# Altium schematic sheet mc_wl.SchDoc
size A4
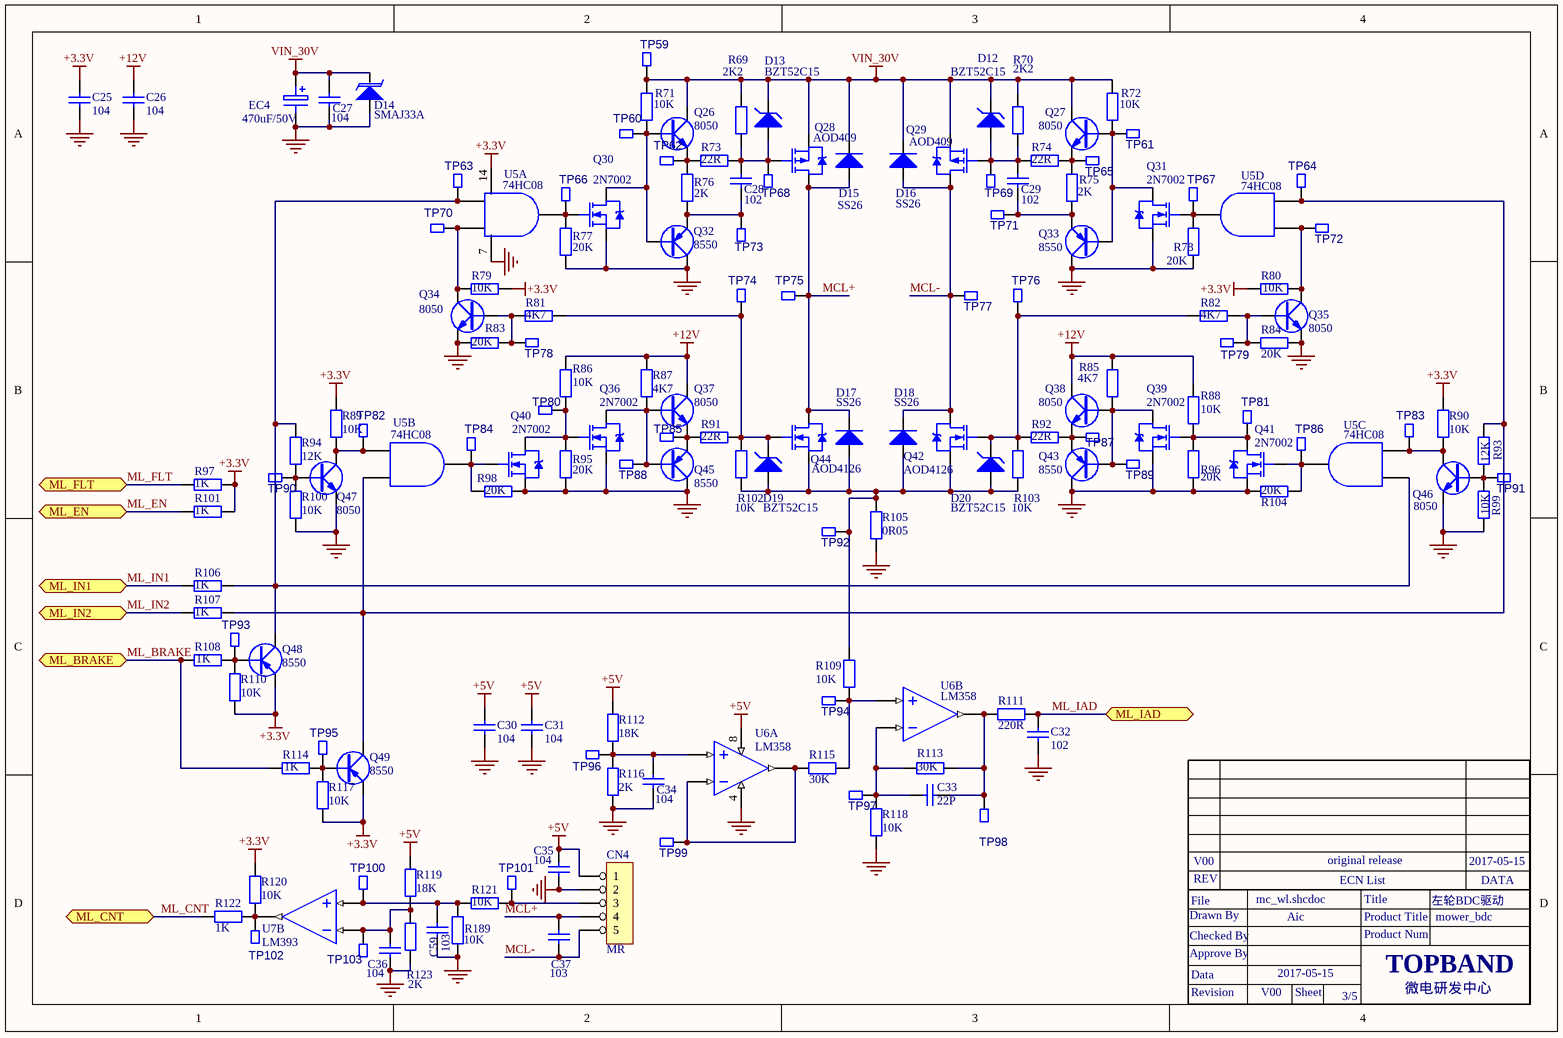
[diagram p0: mc_wl.SchDoc]

## Parts
C25  104  [0603C]
C26  104  [0603C]
C27  104  [0805C]
C28  102  [0805C]
C29  102  [0805C]
C30  104  [0603C]
C31  104  [0603C]
C32  102  [0603C]
C33  22P  [0603C]
C34  104  [0603C]
C35  104  [0603C]
C36  104  [0603C]
C37  103  [1206C]
C59  103  [0603C]
CN4  MR  [CON5-2.54]
D12  BZT52C15  [SOD-123]
D13  BZT52C15  [SOD-123]
D14  SMAJ33A  [DO-214AC]
D15  SS26  [SMB]
D16  SS26  [SMB]
D17  SS26  [SMB]
D18  SS26  [SMB]
D19  BZT52C15  [SOD-123]
D20  BZT52C15  [SOD-123]
EC4  470uF/50V  [EC12.5]
Q26  8050  [SOT-23-BCE]
Q27  8050  [SOT-23-BCE]
Q28  AOD409  [D-PACK-GDS]
Q29  AOD409  [D-PACK-GDS]
Q30  2N7002  [SOT-23-GDS]
Q31  2N7002  [SOT-23-GDS]
Q32  8550  [SOT-23-BCE]
Q33  8550  [SOT-23-BCE]
Q34  8050  [SOT-23-BCE]
Q35  8050  [SOT-23-BCE]
Q36  2N7002  [SOT-23-GDS]
Q37  8050  [SOT-23-BCE]
Q38  8050  [SOT-23-BCE]
Q39  2N7002  [SOT-23-GDS]
Q40  2N7002  [SOT-23-GDS]
Q41  2N7002  [SOT-23-GDS]
Q42  AOD4126  [D-PACK-GDS]
Q43  8550  [SOT-23-BCE]
Q44  AOD4126  [D-PACK-GDS]
Q45  8550  [SOT-23-BCE]
Q46  8050  [SOT-23-BCE]
Q47  8050  [SOT-23-BCE]
Q48  8550  [SOT-23-BCE]
Q49  8550  [SOT-23-BCE]
R69  2K2  [0805R]
R70  2K2  [0805R]
R71  10K  [0603R]
R72  10K  [0603R]
R73  22R  [0805R]
R74  22R  [0805R]
R75  2K  [0805R]
R76  2K  [0805R]
R77  20K  [0603R]
R78  20K  [0603R]
R79  10K  [0603R]
R80  10K  [0603R]
R81  4K7  [0603R]
R82  4K7  [0603R]
R83  20K  [0603R]
R84  20K  [0603R]
R85  4K7  [0603R]
R86  10K  [0603R]
R87  4K7  [0603R]
R88  10K  [0603R]
R89  10K  [0603R]
R90  10K  [0603R]
R91  22R  [0805R]
R92  22R  [0805R]
R93  12K  [0603R]
R94  12K  [0603R]
R95  20K  [0603R]
R96  20K  [0603R]
R97  1K  [0603R]
R98  20K  [0603R]
R99  10K  [0603R]
R100  10K  [0603R]
R101  1K  [0603R]
R102  10K  [0603R]
R103  10K  [0603R]
R104  20K  [0603R]
R105  0R05  [2512R]
R106  1K  [0603R]
R107  1K  [0603R]
R108  1K  [0603R]
R109  10K  [0603R]
R110  10K  [0603R]
R111  220R  [0603R]
R112  18K  [0603R]
R113  30K  [0603R]
R114  1K  [0603R]
R115  30K  [0603R]
R116  2K  [0603R]
R117  10K  [0603R]
R118  10K  [0603R]
R119  18K  [0603R]
R120  10K  [0603R]
R121  10K  [0603R]
R122  1K  [0603R]
R123  2K  [0603R]
R189  10K  [0603R]
TP59  TP  [TEST-0.8MM]  (value not drawn)
TP60  TP  [TEST-0.8MM]  (value not drawn)
TP61  TP  [TEST-0.8MM]  (value not drawn)
TP62  TP  [TEST-0.8MM]  (value not drawn)
TP63  TP  [TEST-0.8MM]  (value not drawn)
TP64  TP  [TEST-0.8MM]  (value not drawn)
TP65  TP  [TEST-0.8MM]  (value not drawn)
TP66  TP  [TEST-0.8MM]  (value not drawn)
TP67  TP  [TEST-0.8MM]  (value not drawn)
TP68  TP  [TEST-0.8MM]  (value not drawn)
TP69  TP  [TEST-0.8MM]  (value not drawn)
TP70  TP  [TEST-0.8MM]  (value not drawn)
TP71  TP  [TEST-0.8MM]  (value not drawn)
TP72  TP  [TEST-0.8MM]  (value not drawn)
TP73  TP  [TEST-0.8MM]  (value not drawn)
TP74  TP  [TEST-0.8MM]  (value not drawn)
TP75  TP  [TEST-0.8MM]  (value not drawn)
TP76  TP  [TEST-0.8MM]  (value not drawn)
TP77  TP  [TEST-0.8MM]  (value not drawn)
TP78  TP  [TEST-0.8MM]  (value not drawn)
TP79  TP  [TEST-0.8MM]  (value not drawn)
TP80  TP  [TEST-0.8MM]  (value not drawn)
TP81  TP  [TEST-0.8MM]  (value not drawn)
TP82  TP  [TEST-0.8MM]  (value not drawn)
TP83  TP  [TEST-0.8MM]  (value not drawn)
TP84  TP  [TEST-0.8MM]  (value not drawn)
TP85  TP  [TEST-0.8MM]  (value not drawn)
TP86  TP  [TEST-0.8MM]  (value not drawn)
TP87  TP  [TEST-0.8MM]  (value not drawn)
TP88  TP  [TEST-0.8MM]  (value not drawn)
TP89  TP  [TEST-0.8MM]  (value not drawn)
TP90  TP  [TEST-0.8MM]  (value not drawn)
TP91  TP  [TEST-0.8MM]  (value not drawn)
TP92  TP  [TEST-0.8MM]  (value not drawn)
TP93  TP  [TEST-0.8MM]  (value not drawn)
TP94  TP  [TEST-0.8MM]  (value not drawn)
TP95  TP  [TEST-0.8MM]  (value not drawn)
TP96  TP  [TEST-0.8MM]  (value not drawn)
TP97  TP  [TEST-0.8MM]  (value not drawn)
TP98  TP  [TEST-0.8MM]  (value not drawn)
TP99  TP  [TEST-0.8MM]  (value not drawn)
TP100  TP  [TEST-0.8MM]  (value not drawn)
TP101  TP  [TEST-0.8MM]  (value not drawn)
TP102  TP  [TEST-0.8MM]  (value not drawn)
TP103  TP  [TEST-0.8MM]  (value not drawn)
U5  74HC08  [SO-14]  (parts A,B,C,D of 4)
U6  LM358  [SO-8]  (parts A,B of 2)
U7  LM393  [SO-8]  (part B of 2)

## Ports
ML_BRAKE, ML_CNT, ML_EN, ML_FLT, ML_IAD, ML_IN1, ML_IN2

## Nets
+3.3V: C25.2 Q48.E Q49.E R79.2 R80.1 R89.1 R90.2 R97.2 R101.2 R110.2 R117.2 R120.2 U5.14(VCC)
+5V: C30.2 C31.2 C35.2 CN4.1 R112.2 R119.2 U6.8(VCC)
+12V: C26.2 Q37.C Q38.C R85.1 R86.2 R87.2 R88.2
GND: C25.1 C26.1 C27.1 C30.1 C31.1 C32.2 C34.1 C35.1 C36.1 C59.1 CN4.2 D14.A EC4.2 Q30.S Q31.S Q32.C Q33.C Q34.E Q35.E Q36.S Q39.S Q40.S Q41.S Q43.C Q45.C Q46.E Q47.E R77.2 R78.1 R83.1 R84.2 R95.2 R96.2 R98.2 R99.1 R100.1 R104.1 R105.1 R116.1 R118.1 R123.1 R189.2 U5.7(GND) U6.4(GND)
VIN_30V: C27.2 D12.K D13.K D14.K D15.K D16.K EC4.1 Q26.C Q27.C Q28.S Q29.S R69.1 R70.1 R71.1 R72.1 TP59.1
MCL+: C37.2 CN4.4 D15.A D17.K Q28.D Q44.D TP75.1
MCL-: C37.1 CN4.5 D16.A D18.K Q29.D Q42.D TP77.1
ML_BRAKE: R108.2 R114.2 ; port ML_BRAKE
ML_CNT: R122.1 ; port ML_CNT
ML_EN: R101.1 ; port ML_EN
ML_FLT: R97.1 ; port ML_FLT
ML_IAD: C32.1 R111.2 ; port ML_IAD
ML_IN1: R106.1 ; port ML_IN1
ML_IN2: R107.1 ; port ML_IN2
NetC28_1: C28.1 D13.A Q28.G R69.2 R73.2 TP68.1
NetC28_2: C28.2 Q32.E R76.2 TP73.1
NetC29_1: C29.1 D12.A Q29.G R70.2 R74.1 TP69.1
NetC29_2: C29.2 Q33.E R75.2 TP71.1
NetC33_1: C33.1 R111.1 R113.1 TP98.1 U6.1(OUT2)
NetC33_2: C33.2 R113.2 R118.2 TP97.1 U6.2(-IN2)
NetC34_2: C34.2 R112.1 R116.2 TP96.1 U6.5(+IN1)
NetC36_2: C36.2 R119.1 R123.2 TP103.1 U7.2(-IN2)
NetC59_2: C59.2 R121.2 R189.1 TP100.1 U7.3(IN2+)
NetCN4_3: CN4.3 R121.1 TP101.1
NetD17_A: D17.A D18.A D19.A D20.A Q42.S Q44.S R102.1 R103.1 R105.2 R109.1 TP92.1
NetD19_K: D19.K Q44.G R81.2 R91.2 R102.2 TP74.1
NetD20_K: D20.K Q42.G R82.1 R92.1 R103.2 TP76.1
NetQ26_B: Q26.B Q30.D Q32.B R71.2 TP60.1
NetQ26_E: Q26.E R73.1 R76.1 TP62.1
NetQ27_B: Q27.B Q31.D Q33.B R72.2 TP61.1
NetQ27_E: Q27.E R74.2 R75.1 TP65.1
NetQ30_G: Q30.G R77.1 TP66.1 U5.3(1Y)
NetQ31_G: Q31.G R78.2 TP67.1 U5.11(4Y)
NetQ34_B: Q34.B R81.1 R83.2 TP78.1
NetQ34_C: Q34.C R79.1 TP70.1 U5.2(1B)
NetQ35_B: Q35.B R82.2 R84.1 TP79.1
NetQ35_C: Q35.C R80.2 TP72.1 U5.12(4A)
NetQ36_D: Q36.D Q37.B Q45.B R87.1 TP88.1
NetQ36_G: Q36.G Q40.D R86.1 R95.1 TP80.1
NetQ37_E: Q37.E Q45.E R91.1 TP85.1
NetQ38_B: Q38.B Q39.D Q43.B R85.2 TP89.1
NetQ38_E: Q38.E Q43.E R92.2 TP87.1
NetQ39_G: Q39.G Q41.D R88.1 R96.1 TP81.1
NetQ40_G: Q40.G R98.1 TP84.1 U5.6(2Y)
NetQ41_G: Q41.G R104.2 TP86.1 U5.8(3Y)
NetQ46_B: Q46.B R93.1 R99.2 TP91.1
NetQ46_C: Q46.C R90.1 TP83.1 U5.10(3B)
NetQ47_B: Q47.B R94.2 R100.2 TP90.1
NetQ47_C: Q47.C R89.2 TP82.1 U5.4(2A)
NetQ48_B: Q48.B R108.1 R110.1 TP93.1
NetQ48_C: Q48.C R94.1 R106.2 TP63.1 U5.1(1A) U5.9(3A)
NetQ49_B: Q49.B R114.1 R117.1 TP95.1
NetQ49_C: Q49.C R93.2 R107.2 TP64.1 U5.5(2B) U5.13(4B)
NetR109_2: R109.2 R115.2 TP94.1 U6.3(IN2+)
NetR115_1: R115.1 TP99.1 U6.6(-IN1) U6.7(OUT1)
NetR120_1: R120.1 R122.2 TP102.1 U7.1(OUT2)

## Notes on the sheet
- Drawn By
- File
- REV
- V00
- mc_wl.shcdoc
- Aic
- original release
- ECN List
- Product Title
- Title
- 左轮BDC驱动
- mower_bdc
- 2017-05-15
- DATA
- Approve By
- Checked By
- Data
- Product Num
- TOPBAND
- Revision
- Sheet
- 3/5
- 微电研发中心

## Library data of the parts
C25-C37 C59 = Cap(0603): Component Kind: standard; Component Type: standard
CN4 = 5Pin(2.54~7.92mm): 插座; U_TABLE: U_SAM01021601; id: 31; Part Number: 5Pin(2.54~7.92mm); Component Kind: Standard; Component Type: Standard; Designator: 5Pin(2.54~7.92mm); Pin Count: 5
D12 D13 D19 D20 = D Zener(贴片): 120301303; U_TABLE: U_SAM010203; id: 25; Description: 稳压二极管; Part Number: D Zener(贴片); Component Kind: standard; Component Type: standard; Pin Count: 2
D14 = Diode(TVS_贴片)_1: 120301346; U_TABLE: U_SAM010203; id: 28; Description: TVS管; Part Number: Diode(TVS_贴片)_1; Component Kind: standard; Component Type: standard; Pin Count: 2
D15-D18 = Diode(DO-35)-D: 二极管; U_TABLE: U_SAM010203; id: 32; Part Number: Diode(DO-35)-D; Component Kind: standard; Component Type: standard; Pin Count: 2
EC4 = Electro(2.5mm): 150200079; U_TABLE: U_SAM010202; id: 42; Description: 电解电容; Part Number: Electro(2.5mm); Component Kind: standard; Component Type: standard; Pin Count: 2
Q26 Q27 Q34 Q35 Q37 Q38 Q46 Q47 = NPN(贴片): 三极管; U_TABLE: U_SAM010204; id: 18; Part Number: NPN(贴片); Component Kind: standard; Component Type: standard; Pin Count: 3
Q28 Q29 = PMOS-2: MOS管; U_TABLE: U_SAM010204; id: 19; Part Number: PMOS-2; Component Kind: standard; Component Type: standard; Pin Count: 3
Q30 Q31 Q36 Q39-Q42 Q44 = NMOS-2: MOS管; U_TABLE: U_SAM010204; id: 17; Part Number: NMOS-2; Component Kind: standard; Component Type: standard; Pin Count: 3
Q32 Q33 Q43 Q45 Q48 Q49 = PNP(贴片): 三极管; U_TABLE: U_SAM010204; id: 20; Part Number: PNP(贴片); Component Kind: standard; Component Type: standard; Pin Count: 3
R69-R96 R98-R100 R102-R105 R120 = Res2: Resistor; Value: 1K; 物料编码: 150103083; Published: 8-Jun-2000; LatestRevisionDate: 17-Jul-2002; LatestRevisionNote: Re-released for DXP Platform.; PackageReference: AXIAL-0.4; Publisher: Altium Limited
R97 R101 R106-R108 R114 = Res2: Resistor; 物料编码: 150103083; Published: 8-Jun-2000; LatestRevisionDate: 17-Jul-2002; LatestRevisionNote: Re-released for DXP Platform.; PackageReference: AXIAL-0.4; Publisher: Altium Limited; Value: 1K
R109 R111 R113 R115 R118 = Res2: Resistor; Value: 1K; Published: 8-Jun-2000; LatestRevisionDate: 17-Jul-2002; LatestRevisionNote: Re-released for DXP Platform.; PackageReference: AXIAL-0.4; Publisher: Altium Limited
R110 R112 R116 R117 R119 R121-R123 R189 = Res2: Resistor; Published: 8-Jun-2000; LatestRevisionDate: 17-Jul-2002; LatestRevisionNote: Re-released for DXP Platform.; PackageReference: AXIAL-0.4; Publisher: Altium Limited
U6 = IC_LM358: 121000225; U_TABLE: U_SAM010210; Description: 集成电路; id: 83; U_ITEM_ID（物料编码）: 121000100; U_100114（SAP物料描述）: SMT运放LM358_SO-8_TI_环保; U_100047（环保属性）: 环保; U_100107（工厂BOM使用频率）: 1000:1;1500:12;3000:7;5000:14;; U_100105（工厂库存）: 1000:7508.000;1500:160.000;2000:0.000;3000:485.000;5000:1542.000;; U_100117（工厂采购量）: 1000:7500.000;1500:300.000;3000:2500.000;5000:7500.000;; Part Number: IC_LM358; Component Kind: standard; Component Type: standard; Designator: IC_LM358; Footprint: DIP14; Pin Count: 8; U_100076（型号）: LM358; U_100040（封装方式）: SO-8; U_100086（指定供应商）: TI
U7 = IC_LM358: 121000225; U_TABLE: U_SAM010210; Description: 集成电路; id: 83; U_ITEM_ID（物料编码）: 121000100; U_100076（型号）: LM358; U_100114（SAP物料描述）: SMT运放LM358_SO-8_TI_环保; U_100047（环保属性）: 环保; U_100107（工厂BOM使用频率）: 1000:1;1500:12;3000:7;5000:14;; U_100105（工厂库存）: 1000:7508.000;1500:160.000;2000:0.000;3000:485.000;5000:1542.000;; U_100117（工厂采购量）: 1000:7500.000;1500:300.000;3000:2500.000;5000:7500.000;; Part Number: IC_LM358; Component Kind: standard; Component Type: standard; Designator: IC_LM358; Footprint: DIP14; Pin Count: 8; U_100040（封装方式）: SO-8; U_100086（指定供应商）: TI